# Altium schematic sheet crw_gyro.SchDoc
size A
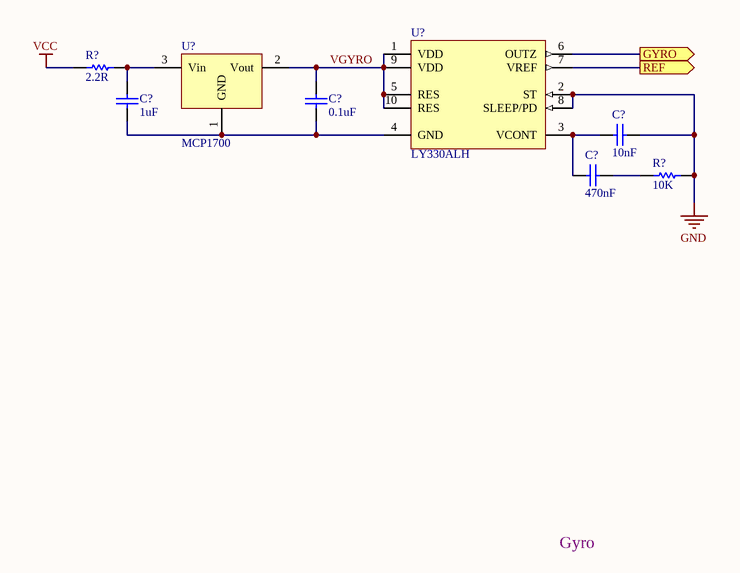
[diagram p0: crw_gyro.SchDoc]

## Parts
(Parts that share a designator on the sheet are numbered #1, #2 ... from top to bottom, then left to right.)
C?#1  value 1uF  [0805]  (hidden comment: C0805)
C?#2  value 0.1uF  [0805]  (hidden comment: C0805)
C?#3  value 10nF  [0805]  (hidden comment: C0805)
C?#4  value 470nF  [0805]  (hidden comment: C0805)
R?#1  value 2.2R  [2012[0805]]  (hidden comment: Res Semi)
R?#2  value 10K  [2012[0805]]  (hidden comment: Res Semi)
U?#1  LY330ALH
U?#2  MCP1700  [SO-G3]

## Ports
GYRO (out), REF (out)

## Nets
GND: C?#3.2 R?#2.1 U?#1.2(ST) U?#1.8(SLEEP/PD)
VCC: R?#1.1
GYRO: U?#1.6(OUTZ) ; port GYRO
REF: U?#1.7(VREF) ; port REF
VGYRO: C?#2.1 U?#1.1(VDD) U?#1.5(RES) U?#1.9(VDD) U?#1.10(RES) U?#2.2(Vout)
NetC?#1_1: C?#1.1 R?#1.2 U?#2.3(Vin)
NetC?#1_2: C?#1.2 C?#2.2 U?#1.4(GND) U?#2.1(GND)
NetC?#3_1: C?#3.1 C?#4.2 U?#1.3(VCONT)
NetC?#4_1: C?#4.1 R?#2.2

## Notes on the sheet
- Gyro

## Library data of the parts
C?#1-C?#4 = C0805: Ceramic Chip Capacitor - Standard; Note: Footprint corresponds to dimensions for bulk cassette packaging. This case size has tightened tolerances.; Published: 17-Jul-2002; LatestRevisionDate: 19-Mar-2004; LatestRevisionNote: Silkscreen size reduced.; DatasheetDocument: Mar-2001; PackageDocument: Mar-2001; PackageReference: 0805; Publisher: Altium Limited; Code_JEITA: 0805; Code_IPC: 2012[0805]; ComponentLink1Description: Manufacturer Link; ComponentLink1URL: http://www.kemet.com/; ComponentLink2Description: Datasheet; ComponentLink2URL: http://www.kemet.com/kemet/web/homepage/kechome.nsf/vapubfilesname/F3102TA.pdf/$file/F3102TA.pdf
R?#1 R?#2 = Res Semi: Semiconductor Resistor; Published: 8-Jun-2000; LatestRevisionDate: 17-Jul-2002; LatestRevisionNote: Re-released for DXP Platform.; PackageReference: AXIAL-0.5; Publisher: Altium Limited
U?#1 = LY330ALH: MEMS motion sensor: high performance ±300 dps analog yaw-rate gyroscope
U?#2 = MCP1702: 2 uA Low Dropout Positive Voltage Regulator